# EAGLE design VCF-LM324-Stereo+LFO-CableConn (EAGLE 7.2.0)
Voltage-Controlled Low-Pass Filter with LFO using LM324 Quad-Opamp (Stereo) http://electro-music.com/forum/topic-45231-0.html&postdays=0&postorder=asc&highlight=
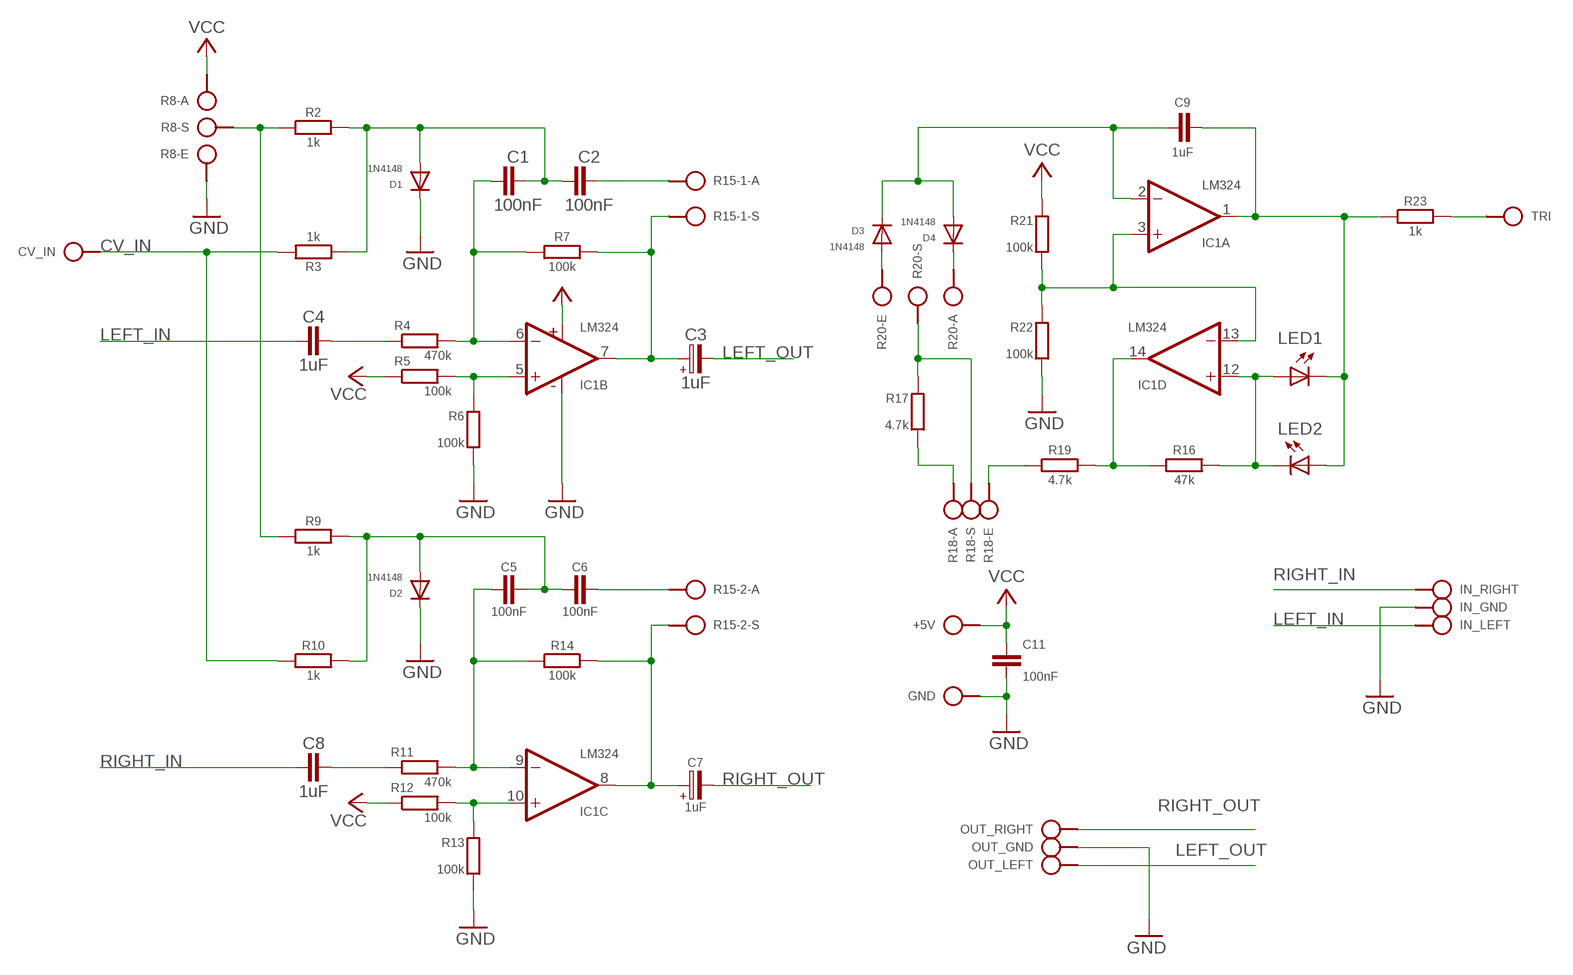
[diagram p0: schematic, sheet 1]

## Parts
+5V  VCC  SPAD  [SPAD]
C1  100nF  C050-024X044  [C050-024X044]
C2  100nF  C050-024X044  [C050-024X044]
C3  1uF  CPOLE2,5-3  [E2,5-3]
C4  1uF  C050-020X044  [C050-020X044]
C5  100nF  C050-024X044  [C050-024X044]
C6  100nF  C050-024X044  [C050-024X044]
C7  1uF  CPOLE2,5-3  [E2,5-3]
C8  1uF  C050-020X044  [C050-020X044]
C9  1uF  C050-024X044/V  [C050-024X044/V]
C11  100nF  C050-020X044  [C050-020X044]
CV_IN  CV_IN  SPAD  [SPAD]
D1  1N4148  1N414834-5V  [DO34-5V]
D2  1N4148  1N414834-7  [DO34-7]
D3  1N4148  1N414834-7V  [DO34-7V]
D4  1N4148  1N414834-7V  [DO34-7V]
GND  GND  SPAD  [SPAD]
IC1  LM324  LM324N  [DIL14]
IN_GND  SPAD  [SPAD]
IN_LEFT  SPAD  [SPAD]
IN_RIGHT  SPAD  [SPAD]
LED1  LED3MM  [LED3MM]
LED2  LED3MM  [LED3MM]
OUT_GND  SPAD  [SPAD]
OUT_LEFT  SPAD  [SPAD]
OUT_RIGHT  SPAD  [SPAD]
R2  1k  R-H0204/10  [0204/10]
R3  1k  R-H0204/10  [0204/10]
R4  470k  R-H0204/7  [0204/7]
R5  100k  R-H0204/2-V  [0204V]
R6  100k  R0204/10  [0204/10]
R7  100k  R-H-V  [0204V]
R8-A  SPAD  [SPAD]
R8-E  SPAD  [SPAD]
R8-S  SPAD  [SPAD]
R9  1k  R-H0204/10-V  [0204/10-V]
R10  1k  R-H0204/10-V  [0204/10-V]
R11  470k  R-H0204/10  [0204/10]
R12  100k  R-H0204/12  [0204/12]
R13  100k  R0204V  [0204V]
R14  100k  R-H0204/10  [0204/10]
R15-1-A  SPAD  [SPAD]
R15-1-S  SPAD  [SPAD]
R15-2-A  SPAD  [SPAD]
R15-2-S  SPAD  [SPAD]
R16  47k  R-H0204/7  [0204/7]
R17  4.7k  R0204/7-V  [0204/7-V]
R18-A  SPAD  [SPAD]
R18-E  SPAD  [SPAD]
R18-S  SPAD  [SPAD]
R19  4.7k  R-H0204/10  [0204/10]
R20-A  SPAD  [SPAD]
R20-E  SPAD  [SPAD]
R20-S  SPAD  [SPAD]
R21  100k  R0204V  [0204V]
R22  100k  R0204/10-V  [0204/10-V]
R23  1k  R-H0204/10  [0204/10]
TRI  TRIANGLE  SPAD  [SPAD]

## Nets
CV_IN: CV_IN.1 R3.2 R10.1
GND: C11.2 D1.C D2.C GND.1 IC1.11(P:V-) IN_GND.1 OUT_GND.1 R6.1 R8-E.1 R13.1 R22.2
LEFT_IN: C4.1 IN_LEFT.1
LEFT_OUT: C3.- OUT_LEFT.1
N$1: R17.1 R18-A.1
N$2: C1.1 IC1.6(B:-IN) R4.2 R7.2
N$3: C2.2 R15-1-A.1
N$4: C3.+ IC1.7(B:OUT) R7.1 R15-1-S.1
N$5: R2.1 R8-S.1 R9.1
N$6: R18-E.1 R19.2
N$7: IC1.5(B:+IN) R5.2 R6.2
N$9: C1.2 C2.1 D1.A R2.2 R3.1
N$10: C4.2 R4.1
N$11: C6.2 R15-2-A.1
N$12: C7.+ IC1.8(C:OUT) R14.2 R15-2-S.1
N$13: IC1.10(C:+IN) R12.2 R13.2
N$14: IC1.14(D:OUT) R16.2 R19.1
N$15: IC1.12(D:+IN) LED1.A LED2.K(C) R16.1
N$16: C5.2 C6.1 D2.A R9.2 R10.2
N$17: C5.1 IC1.9(C:-IN) R11.2 R14.1
N$18: R23.2 TRI.1
N$20: C8.2 R11.1
N$26: C9.1 D3.C D4.A IC1.2(A:-IN)
N$28: C9.2 IC1.1(A:OUT) LED1.K(C) LED2.A R23.1
OA_C_IN+: IC1.3(A:+IN) IC1.13(D:-IN) R21.1 R22.1
RIGHT_IN: C8.1 IN_RIGHT.1
RIGHT_OUT: C7.- OUT_RIGHT.1
TRIM_1_A: D3.A R20-E.1
TRIM_1_B: D4.C R20-A.1
TRIM_P: R17.2 R18-S.1 R20-S.1
VCC: +5V.1 C11.1 IC1.4(P:V+) R5.1 R8-A.1 R12.1 R21.2

## Library data of the parts
+5V CV_IN GND IN_GND IN_LEFT IN_RIGHT OUT_GND OUT_LEFT OUT_RIGHT R8-A R8-E R8-S R15-1-A R15-1-S R15-2-A R15-2-S R18-A R18-E R18-S R20-A R20-E R20-S TRI = pad:SPAD
C1 C2 C4-C6 C8 C9 C11 = c:C: CAPACITOR, European symbol
C3 C7 = c:CPOL: POLARIZED CAPACITOR, European symbol
D1-D4 = d:1N4148
IC1 = ic:LM324: Single Supply Quad Operational Amplifiers http://www.ti.com/lit/ds/symlink/lm324.pdf
LED1 LED2 = led:LED: LED OSRAM: - CHIPLED LG R971, LG N971, LY N971, LG Q971, LY Q971, LO R971, LY R971 LH N974, LH R974 LS Q976, LO Q976, LY Q976 LO Q996 - Hyper CHIPLED LW Q18S LB Q993, LB Q99A, LB R99A - SideLED LS A670, LO A670, LY A670, LG A670, LP A670 LB A673, LV A673, LT A673, LW A673 LH A674 LY A675 LS A676, LA A676, LO A676, LY A676, LW A676 LS A679, LY A679, LG A679 - Hyper Micro SIDELED@@ LS Y876, LA Y876, LO Y876, LY Y876 LT Y87S - SmartLED LW L88C, LW L88S LB L89C, LB L89S, LG L890 LS L89K, LO L89K, LY L89K LS L896, LA L896, LO L896, LY L896 - TOPLED LS T670, LO T670, LY T670, LG T670, LP T670 LSG T670, LSP T670, LSY T670, LOP T670, LYG T670 LG T671, LOG T671, LSG T671 LB T673, LV T673, LT T673, LW T673 LH T674 LS T676, LA T676, LO T676, LY T676, LB T676, LH T676, LSB T676, LW T676 LB T67C, LV T67C, LT T67C, LS T67K, LO T67K, LY T67K, LW E67C LS E67B, LA E67B, LO E67B, LY E67B, LB E67C, LV E67C, LT E67C LW T67C LS T679, LY T679, LG T679 LS T770, LO T770, LY T770, LG T770, LP T770 LB T773, LV T773, LT T773, LW T773 LH T774 LS E675, LA E675, LY E675, LS T675 LS T776, LA T776, LO T776, LY T776, LB T776 LHGB T686 LT T68C, LB T68C - Hyper Mini TOPLED@@ LB M676 - Mini TOPLED Santana@@ LG M470 LS M47K, LO M47K, LY M47K Source: http://www.osram.convergy.de LUXEON: - LUMILED@@ LXK2-PW12-R00, LXK2-PW12-S00, LXK2-PW14-U00, LXK2-PW14-V00 LXK2-PM12-R00, LXK2-PM12-S00, LXK2-PM14-U00 LXK2-PE12-Q00, LXK2-PE12-R00, LXK2-PE12-S00, LXK2-PE14-T00, LXK2-PE14-U00 LXK2-PB12-K00, LXK2-PB12-L00, LXK2-PB12-M00, LXK2-PB14-N00, LXK2-PB14-P00, LXK2-PB14-Q00 LXK2-PR12-L00, LXK2-PR12-M00, LXK2-PR14-Q00, LXK2-PR14-R00 LXK2-PD12-Q00, LXK2-PD12-R00, LXK2-PD12-S00 LXK2-PH12-R00, LXK2-PH12-S00 LXK2-PL12-P00, LXK2-PL12-Q00, LXK2-PL12-R00 Source: www.luxeon.com KINGBRIGHT: KA-3528ASYC Source: www.kingbright.com
R2-R5 R7 R9-R12 R14 R16 R19 R23 = r:R-H
R6 R13 R17 R21 R22 = r:R: RESISTOR, European symbol

## Module LFO
Ports: TRI_OUT(io) GND(io) VCC(io)
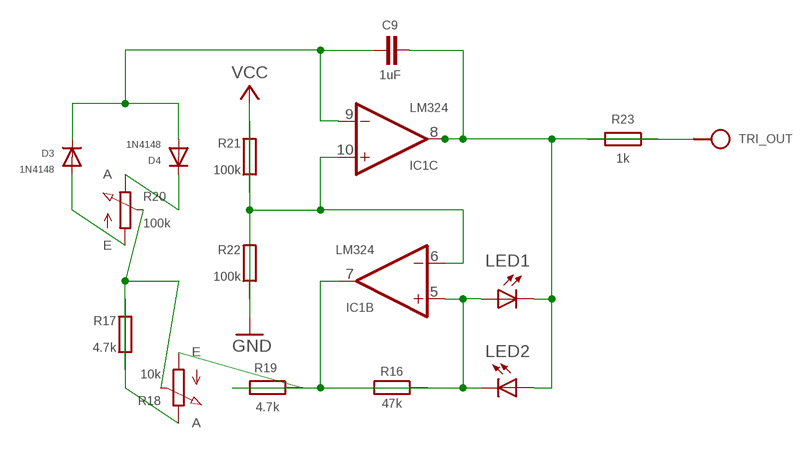
[diagram p1: schematic, module LFO, sheet 1]

### Parts
C9  1uF  C050-024X044/V  [C050-024X044/V]
D3  1N4148  1N414834-7V  [DO34-7V]
D4  1N4148  1N414834-7V  [DO34-7V]
IC1  LM324  LM324N  [DIL14]
LED1  LED3MM  [LED3MM]
LED2  LED3MM  [LED3MM]
R16  47k  R0202/7-V  [0202/7-V]
R17  4.7k  R0202/7  [0202/7]
R18  10k  POT  [POT]
R19  4.7k  R0202/7-V  [0202/7-V]
R20  100k  POT  [POT]
R21  100k  R0202/7-V  [0202/7-V]
R22  100k  R0202/7-V  [0202/7-V]
R23  1k  R0202/7-V  [0202/7-V]
TRI_OUT  TRIANGLE  SPAD  [SPAD]

### Nets
GND: R22.2
N$14: IC1.7(B:OUT) R16.1 R19.2
N$15: IC1.5(B:+IN) LED1.A LED2.K(C) R16.2
N$26: C9.1 D3.C D4.A IC1.9(C:-IN)
N$28: C9.2 IC1.8(C:OUT) LED1.K(C) LED2.A R23.1
OA_C_IN+: IC1.6(B:-IN) IC1.10(C:+IN) R21.2 R22.1
TRI_OUT: R23.2 TRI_OUT.1
TRIM_1_A: D3.A R20.1(A)
TRIM_1_B: D4.C R20.3(E)
TRIM_2_A: R17.2 R18.3(E)
TRIM_2_B: R18.1(A) R19.1
TRIM_P: R17.1 R18.2(S) R20.2(S)
VCC: R21.1
Unconnected: IC1.1(A:OUT) IC1.2(A:-IN) IC1.3(A:+IN) IC1.12(D:+IN) IC1.13(D:-IN) IC1.14(D:OUT)

### Power pins joined to a net without a drawn wire
V+: IC1.4(P:V+)
V-: IC1.11(P:V-)

### Library data of the parts
C9 = c:C: CAPACITOR, European symbol
D3 D4 = d:1N4148
IC1 = ic:LM324: Single Supply Quad Operational Amplifiers http://www.ti.com/lit/ds/symlink/lm324.pdf
LED1 LED2 = led:LED: LED OSRAM: - CHIPLED LG R971, LG N971, LY N971, LG Q971, LY Q971, LO R971, LY R971 LH N974, LH R974 LS Q976, LO Q976, LY Q976 LO Q996 - Hyper CHIPLED LW Q18S LB Q993, LB Q99A, LB R99A - SideLED LS A670, LO A670, LY A670, LG A670, LP A670 LB A673, LV A673, LT A673, LW A673 LH A674 LY A675 LS A676, LA A676, LO A676, LY A676, LW A676 LS A679, LY A679, LG A679 - Hyper Micro SIDELED@@ LS Y876, LA Y876, LO Y876, LY Y876 LT Y87S - SmartLED LW L88C, LW L88S LB L89C, LB L89S, LG L890 LS L89K, LO L89K, LY L89K LS L896, LA L896, LO L896, LY L896 - TOPLED LS T670, LO T670, LY T670, LG T670, LP T670 LSG T670, LSP T670, LSY T670, LOP T670, LYG T670 LG T671, LOG T671, LSG T671 LB T673, LV T673, LT T673, LW T673 LH T674 LS T676, LA T676, LO T676, LY T676, LB T676, LH T676, LSB T676, LW T676 LB T67C, LV T67C, LT T67C, LS T67K, LO T67K, LY T67K, LW E67C LS E67B, LA E67B, LO E67B, LY E67B, LB E67C, LV E67C, LT E67C LW T67C LS T679, LY T679, LG T679 LS T770, LO T770, LY T770, LG T770, LP T770 LB T773, LV T773, LT T773, LW T773 LH T774 LS E675, LA E675, LY E675, LS T675 LS T776, LA T776, LO T776, LY T776, LB T776 LHGB T686 LT T68C, LB T68C - Hyper Mini TOPLED@@ LB M676 - Mini TOPLED Santana@@ LG M470 LS M47K, LO M47K, LY M47K Source: http://www.osram.convergy.de LUXEON: - LUMILED@@ LXK2-PW12-R00, LXK2-PW12-S00, LXK2-PW14-U00, LXK2-PW14-V00 LXK2-PM12-R00, LXK2-PM12-S00, LXK2-PM14-U00 LXK2-PE12-Q00, LXK2-PE12-R00, LXK2-PE12-S00, LXK2-PE14-T00, LXK2-PE14-U00 LXK2-PB12-K00, LXK2-PB12-L00, LXK2-PB12-M00, LXK2-PB14-N00, LXK2-PB14-P00, LXK2-PB14-Q00 LXK2-PR12-L00, LXK2-PR12-M00, LXK2-PR14-Q00, LXK2-PR14-R00 LXK2-PD12-Q00, LXK2-PD12-R00, LXK2-PD12-S00 LXK2-PH12-R00, LXK2-PH12-S00 LXK2-PL12-P00, LXK2-PL12-Q00, LXK2-PL12-R00 Source: www.luxeon.com KINGBRIGHT: KA-3528ASYC Source: www.kingbright.com
R16 R17 R19 R21-R23 = r:R: RESISTOR, European symbol
R18 R20 = r:POT
TRI_OUT = pad:SPAD

## Module VCF-L
Ports: 

### Library data of the parts

## Net classes
0 default: width 0.61 mm

## Board
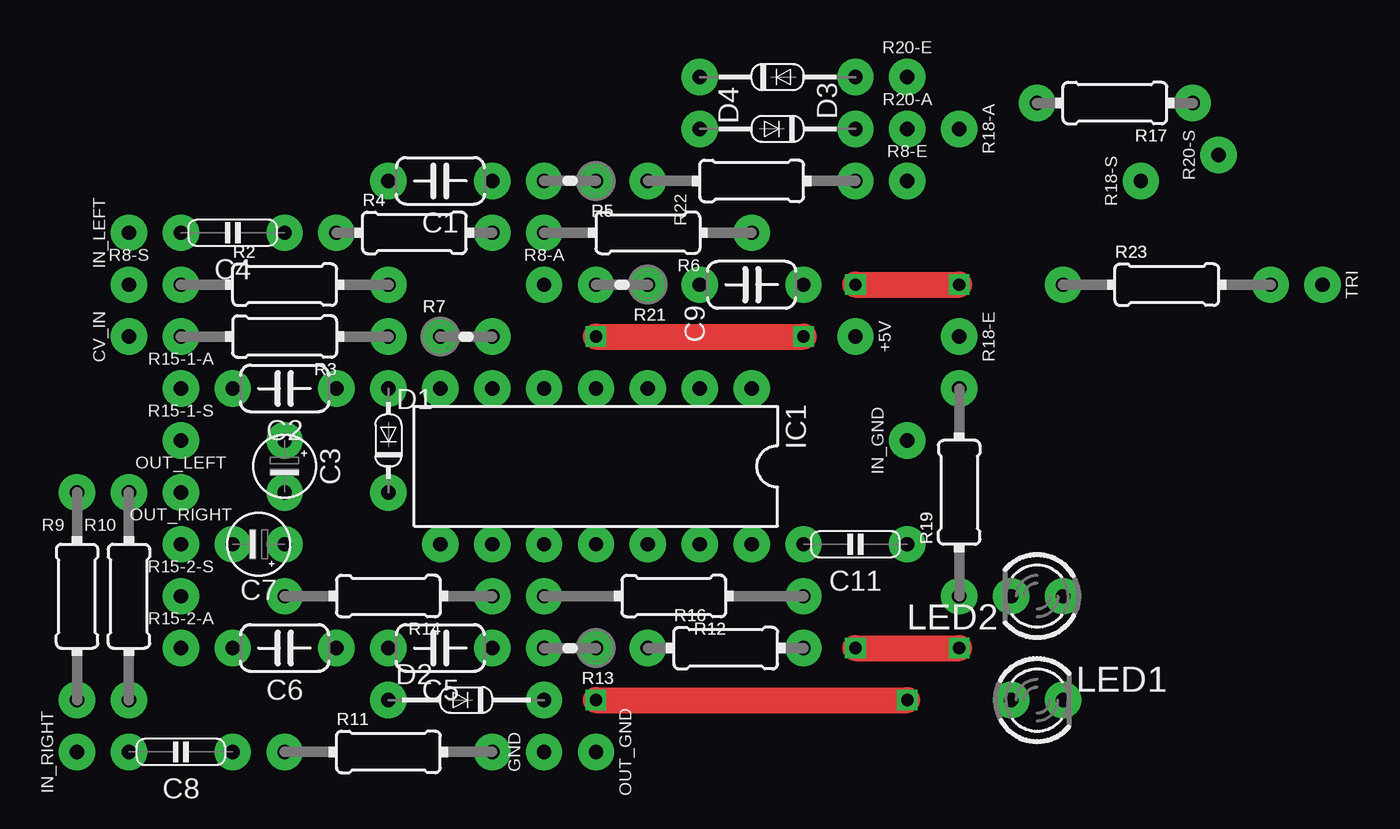
[diagram p2: board, top side]
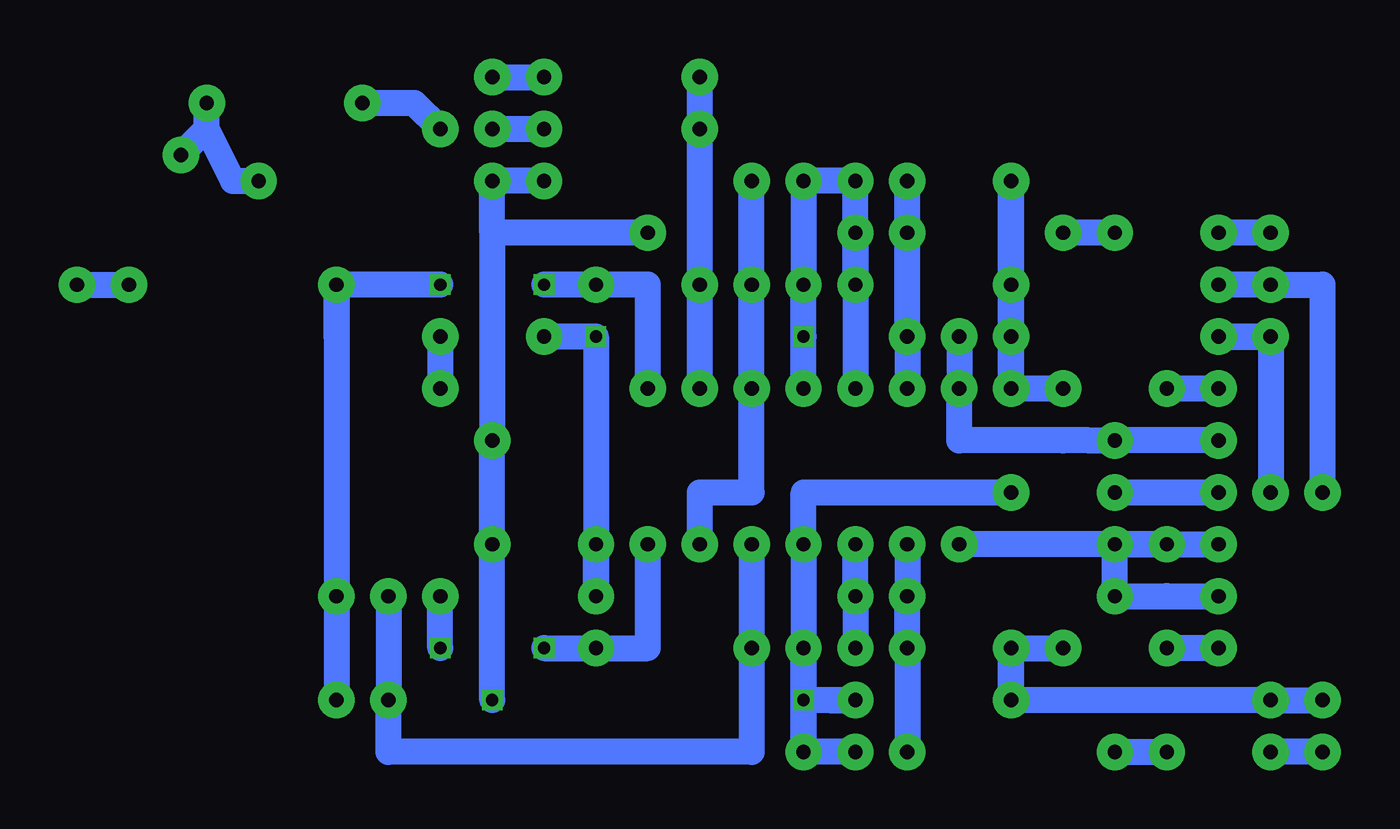
[diagram p3: board, bottom side, seen from below]

No outline drawn. Coordinates in mm, seen from the top.
Copper layers (1*16): Top 0.035mm / dielectric 1.5mm / Bottom 0.035mm
Design rules "default": minimum track width 10mil, minimum drill 24mil, track to track 8mil, track to pad 8mil, pad to pad 8mil, via to via 8mil, smd to smd 8mil, copper to edge 40mil, drill to drill 8mil, minimum pad ring 10mil, minimum via ring 8mil, stop-mask expansion 4mil, vias tented up to drill 0mil, thermal gap 10mil

### Footprints (pad centres in the part's own frame; a part is rotated, then mirrored left to right if it is on the bottom)
SPAD = drill 0.7 pad 1.778: 1 0,0
C050-024X044 = drill 0.7 pad 1.778: 1 -2.54,0; 2 2.54,0
E2,5-3 = drill 0.7 pad 1.778: + 0,1.27; - 0,-1.27
C050-020X044 = drill 0.7 pad 1.778: 1 2.54,0; 2 -2.54,0
C050-024X044/V = drill 0.7 pad 1.778: 1 0,2.54; 2 0,-2.54
DO34-5V = drill 0.7 pad 1.778: A 0,2.54; C 0,-2.54
DO34-7 = drill 0.7 pad 1.778: A 3.81,0; C -3.81,0
DO34-7V = drill 0.7 pad 1.778: A 0,3.81; C 0,-3.81
DIL14 = drill 0.7 pad 1.778: 1 -3.81,7.62; 2 -3.81,5.08; 3 -3.81,2.54; 4 -3.81,0; 5 -3.81,-2.54; 6 -3.81,-5.08; 7 -3.81,-7.62; 8 3.81,-7.62; 9 3.81,-5.08; 10 3.81,-2.54; 11 3.81,0; 12 3.81,2.54; 13 3.81,5.08; 14 3.81,7.62
LED3MM = drill 0.7 pad 1.778: A -1.27,0; K 1.27,0
0204/10 = drill 0.7 pad 1.778: 1 -5.08,0; 2 5.08,0
0204/7 = drill 0.7 pad 1.778: 1 -3.81,0; 2 3.81,0
0204V = drill 0.7 pad 1.778: 1 -1.27,0; 2 1.27,0
0204/10-V = drill 0.7 pad 1.778: 1 0,5.08; 2 0,-5.08
0204/12 = drill 0.7 pad 1.778: 1 -6.35,0; 2 6.35,0
0204/7-V = drill 0.7 pad 1.778: 1 0,3.81; 2 0,-3.81

### Placement (x,y rotation side)
+5V  55.88,38.1 180 top
C1  35.56,45.72 180 top
C2  27.94,35.56 180 top
C3  1μF  [E2,5-3]  27.94,31.75 0 top
C4  1μF  [C050-020X044]  25.4,43.18 180 top
C5  35.56,22.86 180 top
C6  27.94,22.86 180 top
C7  1μF  [E2,5-3]  26.67,27.94 270 top
C8  1μF  [C050-020X044]  22.86,17.78 180 top
C9  1μF  [C050-024X044/V]  50.8,40.64 90 top
C11  55.88,27.94 180 top
CV_IN  20.32,38.1 0 top
D1  33.02,33.02 0 top
D2  36.83,20.32 180 top
D3  52.07,50.8 270 top
D4  52.07,48.26 90 top
GND  40.64,17.78 0 top
IC1  43.18,31.75 270 top
IN_GND  58.42,33.02 0 top
IN_LEFT  20.32,43.18 0 top
IN_RIGHT  17.78,17.78 0 top
LED1  64.77,20.32 0 top
LED2  64.77,25.4 180 top
OUT_GND  43.18,17.78 180 top
OUT_LEFT  22.86,30.48 270 top
OUT_RIGHT  22.86,27.94 270 top
R2  1kΩ  [0204/10]  27.94,40.64 0 top
R3  1kΩ  [0204/10]  27.94,38.1 180 top
R4  470kΩ  [0204/7]  34.29,43.18 0 top
R5  100kΩ  [0204V]  41.91,45.72 180 top
R6  100kΩ  [0204/10]  45.72,43.18 180 top
R7  100kΩ  [0204V]  36.83,38.1 0 top
R8-A  40.64,40.64 270 top
R8-E  58.42,45.72 270 top
R8-S  20.32,40.64 270 top
R9  1kΩ  [0204/10-V]  17.78,25.4 0 top
R10  1kΩ  [0204/10-V]  20.32,25.4 0 top
R11  470kΩ  [0204/10]  33.02,17.78 0 top
R12  100kΩ  [0204/12]  46.99,25.4 180 top
R13  100kΩ  [0204V]  41.91,22.86 180 top
R14  100kΩ  [0204/10]  33.02,25.4 180 top
R15-1-A  22.86,35.56 270 top
R15-1-S  22.86,33.02 270 top
R15-2-A  22.86,22.86 270 top
R15-2-S  22.86,25.4 270 top
R16  47kΩ  [0204/7]  49.53,22.86 0 top
R17  4.7kΩ  [0204/7-V]  68.58,49.53 90 top
R18-A  60.96,48.26 180 top
R18-E  60.96,38.1 180 top
R18-S  69.85,45.72 0 top
R19  4.7kΩ  [0204/10]  60.96,30.48 90 top
R20-A  58.42,48.26 270 top
R20-E  58.42,50.8 270 top
R20-S  73.66,46.99 0 top
R21  100kΩ  [0204V]  44.45,40.64 180 top
R22  100kΩ  [0204/10-V]  50.8,45.72 90 top
R23  1kΩ  [0204/10]  71.12,40.64 0 top
TRI  78.74,40.64 180 top

### Tracks (layer width: path | path; a pad name or v marks a point on that pad's centre or on a via)
CV_IN
  Bottom 1.27: CV_IN.1 R3.2 CV_IN.1 | CV_IN.1 R10.1
GND  (via drill 0.6)
  Top 1.27: v43.18,20.32 v58.42,20.32
  Bottom 1.27: v43.18,20.32 IC1.11 43.18,30.48 D1.C | 41.91,20.32 D2.C v43.18,20.32 | 43.18,21.59 R13.1 OUT_GND.1 | v43.18,20.32 OUT_GND.1 | GND.1 OUT_GND.1 | v58.42,20.32 C11.2 IN_GND.1 58.42,43.18 | 58.42,43.18 R8-E.1 R22.2 | R6.1 58.42,43.18
LEFT_IN
  Bottom 1.27: IN_LEFT.1 C4.1
LEFT_OUT
  Bottom 1.27: C3.- OUT_LEFT.1
N$1
  Bottom 1.27: R17.1 62.23,49.53 R18-A.1 | R17.1 | R18-A.1
N$2
  Bottom 1.27: R7.2 IC1.6 | IC1.6 | R7.2 | R7.2 38.1,40.64 | R7.2 | 38.1,40.64 R4.2 | R4.2 | 38.1,40.64 C1.1
N$3
  Bottom 1.27: R15-1-A.1 C2.2
N$4
  Bottom 1.27: R7.1 IC1.7 | IC1.7 | R7.1 | R15-1-S.1 C3.+ 29.21,33.02 30.48,33.02 35.56,33.02 IC1.7 | IC1.7 | IC1.7
N$5
  Bottom 1.27: R9.1 17.78,40.64 R8-S.1 R2.1
N$6
  Bottom 1.27: R18-E.1 R19.2
N$7
  Bottom 1.27: IC1.5 R6.2 R5.2
N$9
  Bottom 1.27: R2.2 R3.1 | R3.1 D1.A | R3.1 C1.2 | C1.2 D1.A | R3.1 R2.2 | C2.1 D1.A | D1.A R2.2 | R2.2 C1.2
N$10
  Bottom 1.27: C4.2 | C4.2 | C4.2 R4.1
N$11
  Bottom 1.27: R15-2-A.1 C6.2 | C6.2 | R15-2-A.1
N$12
  Bottom 1.27: R14.2 C7.+ | C7.+ | R14.2 | C7.+ IC1.8 | IC1.8 | C7.+ | R14.2 25.4,25.4 R15-2-S.1 | R14.2
N$13
  Bottom 1.27: R13.2 R12.2 IC1.10
N$14  (via drill 0.6)
  Top 1.27: v55.88,22.86 v60.96,22.86
  Bottom 1.27: IC1.14 50.8,22.86 R16.2 v55.88,22.86 | v60.96,22.86 R19.1 | v55.88,22.86
N$15
  Bottom 1.27: R16.1 IC1.12 45.72,17.78 63.5,17.78 LED1.A LED2.K
N$16
  Bottom 1.27: C5.2 C6.1 | C5.2 D2.A | D2.A | C5.2 | R9.2 R10.2 D2.A | D2.A C5.2 | C5.2 | C6.1
N$17
  Bottom 1.27: IC1.9 R14.1 | R14.1 | IC1.9 | C5.1 R11.2 | R11.2 | C5.1 | C5.1 R14.1 | R14.1 | C5.1
N$18
  Bottom 1.27: TRI.1 R23.2
N$20
  Bottom 1.27: R11.1 C8.2 | C8.2 | R11.1
N$26
  Bottom 1.27: IC1.2 C9.1 D4.A D3.C
N$28  (via drill 0.6)
  Top 1.27: v55.88,40.64 v60.96,40.64
  Bottom 1.27: IC1.1 50.8,40.64 C9.2 v55.88,40.64 | v60.96,40.64 R23.1 | 66.04,38.1 R23.1 | R23.1 LED2.A LED1.K | 66.04,38.1 R23.1 | 66.04,38.1
OA_C_IN+
  Bottom 1.27: IC1.13 48.26,30.48 45.72,30.48 IC1.3 R21.1 R22.1
RIGHT_IN
  Bottom 1.27: IN_RIGHT.1 C8.1
RIGHT_OUT
  Bottom 1.27: C7.- 27.94,27.94 C7.- | C7.- OUT_RIGHT.1
TRIM_1_A
  Bottom 1.27: R20-E.1 D3.A
TRIM_1_B
  Bottom 1.27: R20-A.1 D4.C | D4.C | R20-A.1
TRIM_P
  Bottom 1.27: 72.39,48.26 R17.2 | R20-S.1 72.39,48.26 | 72.39,48.26 | R17.2 | R20-S.1 | R18-S.1 71.12,45.72 72.39,48.26 | R18-S.1
VCC  (via drill 0.6)
  Top 1.27: v43.18,38.1 v53.34,38.1
  Bottom 1.27: IC1.4 v43.18,38.1 R21.2 R5.1 | v53.34,38.1 R12.1 C11.1 | R8-A.1 40.64,45.72 R5.1 | R5.1 43.18,44.45 | v53.34,38.1 +5V.1 | +5V.1 | v53.34,38.1